# Altium schematic sheet S4_Power_Supply.SchDoc: Power Supply
size Tabloid; DrawnBy: Dhrumil Parikh; SheetNumber: 4; SheetTotal: 6; PageSetup: Record=PageOptions|CenterHorizontal=True|CenterVertical=True|PrintScale=0.62|XCorrection=1.00|YCorrection=1.00|PrintKind=1|BorderSize=5000000|LeftOffset=0|BottomOffset=0|Orientation=2|PaperLength=1000|PaperWidth=1000|Scale=100|PaperSource=7|PrintQuality=600|MediaType=1|DitherType=10|PaperKind=Letter|PrintScaleMode=1; PageSize: T
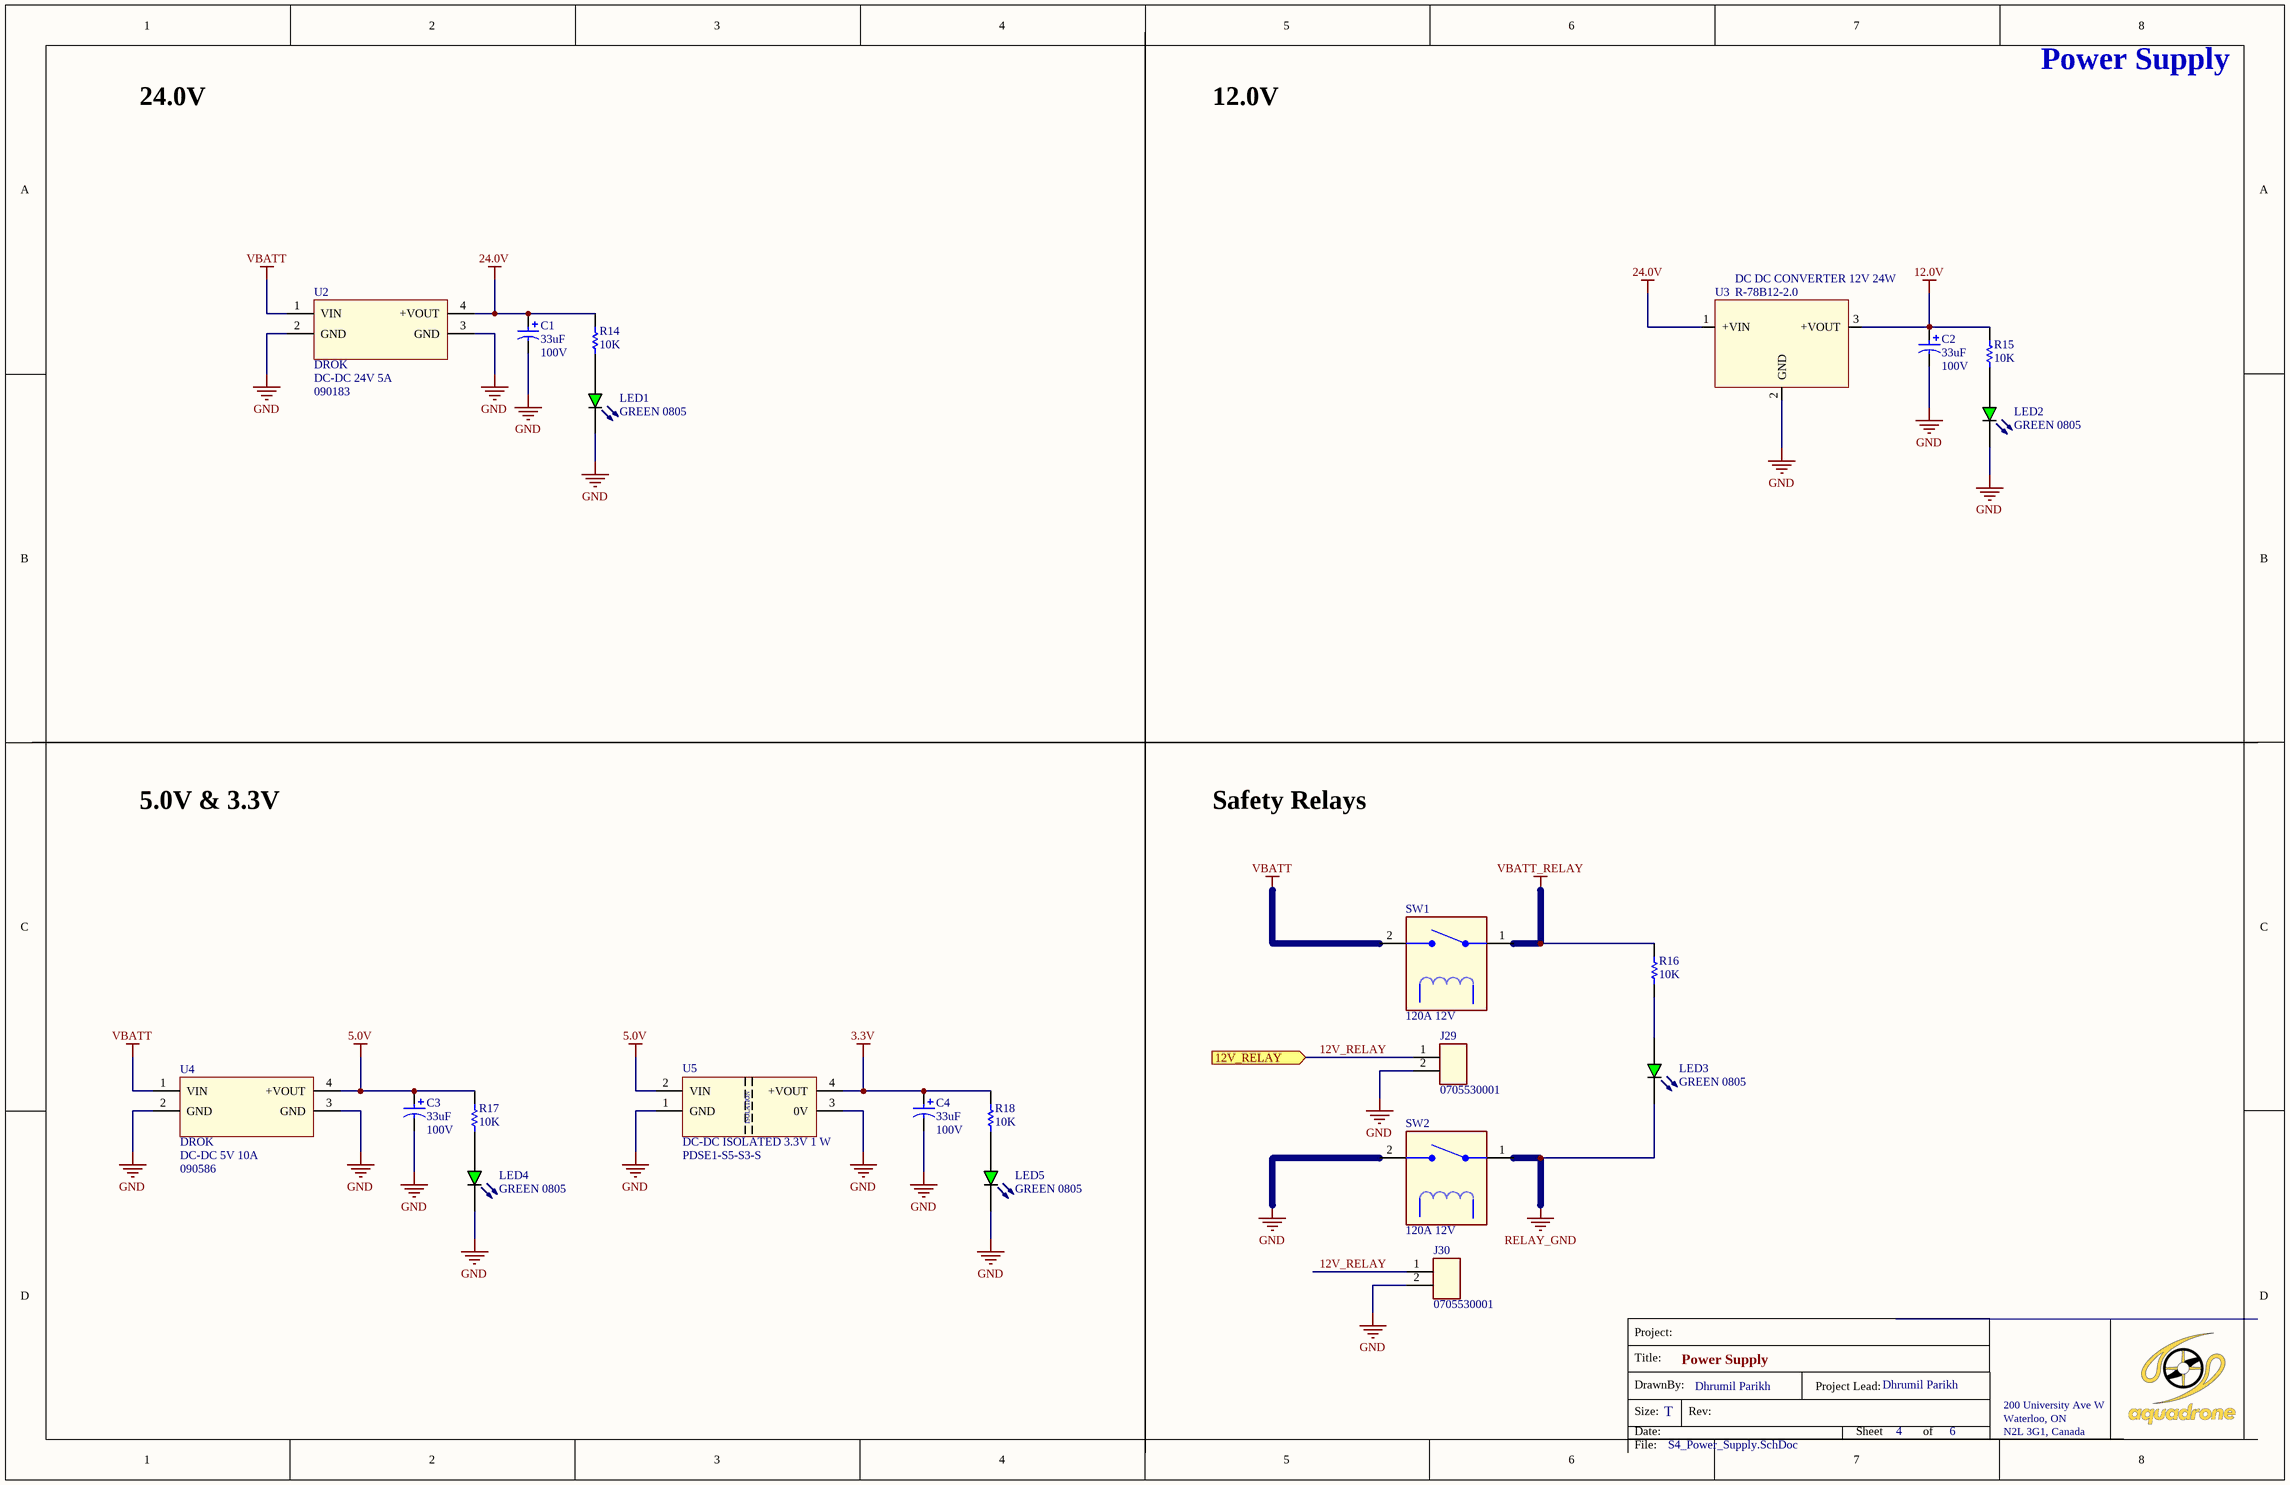
[diagram p0: S4_Power_Supply.SchDoc]

## Parts
C1  value 33uF  VOLTAGE: 100V  [CAPPRD350W60D825H1700]  (hidden comment: CAP ALUM 33UF 20% 100V RADIAL)
C2  value 33uF  VOLTAGE: 100V  [CAPPRD350W60D825H1700]  (hidden comment: CAP ALUM 33UF 20% 100V RADIAL)
C3  value 33uF  VOLTAGE: 100V  [CAPPRD350W60D825H1700]  (hidden comment: CAP ALUM 33UF 20% 100V RADIAL)
C4  value 33uF  VOLTAGE: 100V  [CAPPRD350W60D825H1700]  (hidden comment: CAP ALUM 33UF 20% 100V RADIAL)
J29  value 0705530001  [SHDRRA2W109P0_254_1X2_762X1359X699P]  (hidden comment: CONN HEADER R/A 2POS 2.54MM)
J30  value 0705530001  [SHDRRA2W109P0_254_1X2_762X1359X699P]  (hidden comment: CONN HEADER R/A 2POS 2.54MM)
LED1  value GREEN 0805  [LED0805]  (hidden comment: LED GREEN CLEAR 0805 SMD)
LED2  value GREEN 0805  [LED0805]  (hidden comment: LED GREEN CLEAR 0805 SMD)
LED3  value GREEN 0805  [LED0805]  (hidden comment: LED GREEN CLEAR 0805 SMD)
LED4  value GREEN 0805  [LED0805]  (hidden comment: LED GREEN CLEAR 0805 SMD)
LED5  value GREEN 0805  [LED0805]  (hidden comment: LED GREEN CLEAR 0805 SMD)
R14  value 10K  [RESC1608X06N]  (hidden comment: RES SMD 10K OHM 1% 1/10W 0603)
R15  value 10K  [RESC1608X06N]  (hidden comment: RES SMD 10K OHM 1% 1/10W 0603)
R16  value 10K  [RESC1608X06N]  (hidden comment: RES SMD 10K OHM 1% 1/10W 0603)
R17  value 10K  [RESC1608X06N]  (hidden comment: RES SMD 10K OHM 1% 1/10W 0603)
R18  value 10K  [RESC1608X06N]  (hidden comment: RES SMD 10K OHM 1% 1/10W 0603)
SW1  value 120A 12V  [G9TB-U1ATW-E DC12]  (hidden comment: RELAY GEN PURPOSE SPST 120A 12V)
SW2  value 120A 12V  [G9TB-U1ATW-E DC12]  (hidden comment: RELAY GEN PURPOSE SPST 120A 12V)
U2  MFG: DROK  MFG_PART_NO: 090183  [DROK 090183 24V 5A]  (hidden comment: DC-DC 24V 5A)
U3  DC DC CONVERTER 12V 24W  [R-78B12-2.0]
U4  MFG: DROK  MFG_PART_NO: 090586  [DROK 090586 5V 10A]  (hidden comment: DC-DC 5V 10A)
U5  MFG_PART_NO: PDSE1-S5-S3-S  [PDSE1S5S3S]  (hidden comment: DC-DC ISOLATED 3.3V 1 W)

## Ports
12V_RELAY (in)

## Nets
3.3V: C4.1 R18.2 U5.4(+VOUT)
5.0V: C3.1 R17.2 U4.4(+VOUT) U5.2(VIN)
12.0V: C2.1 R15.2 U3.3(+VOUT)
24.0V: C1.1 R14.2 U2.4(+VOUT) U3.1(+VIN)
GND: C1.2 C2.2 C3.2 C4.2 J29.2 J30.2 LED1.K LED2.K LED4.K LED5.K SW2.2 U2.2(GND) U2.3(GND) U3.2(GND) U4.2(GND) U4.3(GND) U5.1(GND) U5.3(0V)
RELAY_GND: LED3.K SW2.1
VBATT: SW1.2 U2.1(VIN) U4.1(VIN)
VBATT_RELAY: R16.2 SW1.1
12V_RELAY: J29.1 J30.1 ; port 12V_RELAY
NetLED1_A: LED1.A R14.1
NetLED2_A: LED2.A R15.1
NetLED3_A: LED3.A R16.1
NetLED4_A: LED4.A R17.1
NetLED5_A: LED5.A R18.1

## Notes on the sheet
- 24.0V
- 12.0V
- 5.0V & 3.3V
- Safety Relays
- Title:
- Project:
- Size:
- Date:
- DrawnBy:
- Rev:
- Project Lead:
- Sheet
- Dhrumil Parikh
- of
- 200 University Ave W
- Waterloo, ON
- N2L 3G1, Canada
- File:
- (in symbol DC-DC ISOLATED 3.3V 1 W) ISOLATION

## Library data of the parts
C1-C4 = CAP ALUM 33UF 20% 100V RADIAL: MFG_PART_NO: UPM2A330MPD1TD; MFG: Nichicon; COST: 0.18; TOLERANCE: 20%; DIELECTRIC: ALUM
J29 J30 = CONN HEADER R/A 2POS 2.54MM: MFG: Molex; COST: 1.12; MFG_PART_NO: 0705530001
LED1-LED5 = LED GREEN CLEAR 0805 SMD: MFG_PART_NO: 150080VS75000; MFG: Würth Elektronik; COST: 0.26
R14-R18 = RES SMD 10K OHM 1% 1/10W 0603: MFG_PART_NO: CRCW060310K0FKEA; MFG: Vishay Dale; COST: 0.15; TOLERANCE: 1%
SW1 SW2 = RELAY GEN PURPOSE SPST 120A 12V: MFG: Omron; COST: 23.27; MFG_PART_NO: G9TB-U1ATW-E DC12
U3 = DC DC CONVERTER 12V 24W: MFG: Recom Power; COST: 14.18; VALUE: DC DC CONVERTER 12V 24W; MFG_PART_NO: R-78B12-2.0
U5 = DC-DC ISOLATED 3.3V 1 W: MFG: CUI Inc.; COST: 3.07; VALUE: DC-DC ISOLATED 3.3V 1 W
U2 = DC-DC 24V 5A: COST: 30; VALUE: DC-DC 24V 5A
U4 = DC-DC 5V 10A: COST: 15; VALUE: DC-DC 5V 10A